# Altium project Lesson_06.PrjPcb
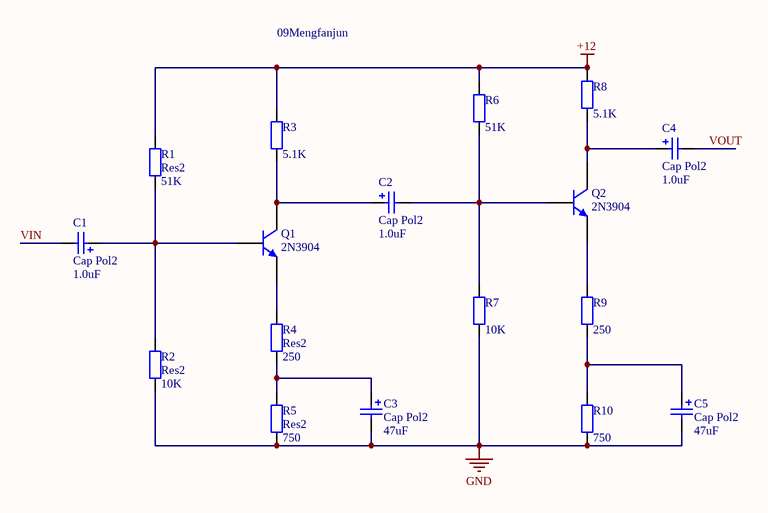
[diagram p0: Lesson_06.SchDoc]
1 sheet, 17 parts. Net scope: global (net labels, ports and power ports of the same name join across sheets).
Board file: Lesson_06_1.PcbDoc

## Sheet Lesson_06.SchDoc
size A4

### Parts
C1  Cap Pol2  value 1.0uF  [POLAR0.8]
C2  Cap Pol2  value 1.0uF  [POLAR0.8]
C3  Cap Pol2  value 47uF  [POLAR0.8]
C4  Cap Pol2  value 1.0uF  [POLAR0.8]
C5  Cap Pol2  value 47uF  [POLAR0.8]
Q1  2N3904  [TO-92A]
Q2  2N3904  [TO-92A]
R1  Res2  value 51K  [AXIAL-0.4]
R2  Res2  value 10K  [AXIAL-0.4]
R3  value 5.1K  [AXIAL-0.4]  (hidden comment: Res2)
R4  Res2  value 250  [AXIAL-0.4]
R5  Res2  value 750  [AXIAL-0.4]
R6  value 51K  [AXIAL-0.4]  (hidden comment: Res2)
R7  value 10K  [AXIAL-0.4]
R8  value 5.1K  [AXIAL-0.4]  (hidden comment: Res2)
R9  value 250  [AXIAL-0.4]  (hidden comment: Res2)
R10  value 750  [AXIAL-0.4]  (hidden comment: Res2)

### Nets
+12: R1.2 R3.2 R6.2 R8.2
GND: C3.2 C5.2 R2.1 R5.1 R7.1 R10.1
VIN: C1.2
VOUT: C4.2
NetC1_1: C1.1 Q1.2(B) R1.1 R2.2
NetC2_1: C2.1 Q1.3(C) R3.1
NetC2_2: C2.2 Q2.2(B) R6.1 R7.2
NetC3_1: C3.1 R4.1 R5.2
NetC4_1: C4.1 Q2.3(C) R8.1
NetC5_1: C5.1 R9.1 R10.2
NetQ1_1: Q1.1(E) R4.2
NetQ2_1: Q2.1(E) R9.2

### Notes on the sheet
- 09Mengfanjun

### Library data of the parts
C1-C5 = Cap Pol2: Polarized Capacitor (Axial); Published: 8-Jun-2000; LatestRevisionDate: 17-Jul-2002; LatestRevisionNote: Re-released for DXP Platform.; PackageReference: POLAR0.8; Publisher: Altium Limited; PackageDescription: Polarized Capacitor; 2 Leads
Q1 Q2 = 2N3904: NPN General Purpose Amplifier; Published: 8-Jun-2000; LatestRevisionDate: 15-Jan-2003; LatestRevisionNote: PCB Footprint 'BCY-W3/D4.7' replaced; DatasheetVersion: 1997; PackageVersion: Sep-1998; PackageReference: TO-92A; Publisher: Altium Limited; PackageDescription: TO, Flat Index; 3 In-Line, Axial Leads; Body Dia. 4.5mm; Leads 0.51 x 0.48 mm (max); ComponentLink1Description: Manufacturer Link; ComponentLink1URL: http://www.fairchildsemi.com/; ComponentLink2Description: Datasheet; ComponentLink2URL: http://www.fairchildsemi.com/ds/2N%2F2N3904.pdf
R1-R10 = Res2: Resistor; Published: 8-Jun-2000; LatestRevisionDate: 17-Jul-2002; LatestRevisionNote: Re-released for DXP Platform.; PackageReference: AXIAL-0.4; Publisher: Altium Limited; PackageDescription: Axial Device, Thru-Hole; 2 Leads; 0.4 in Pin Spacing